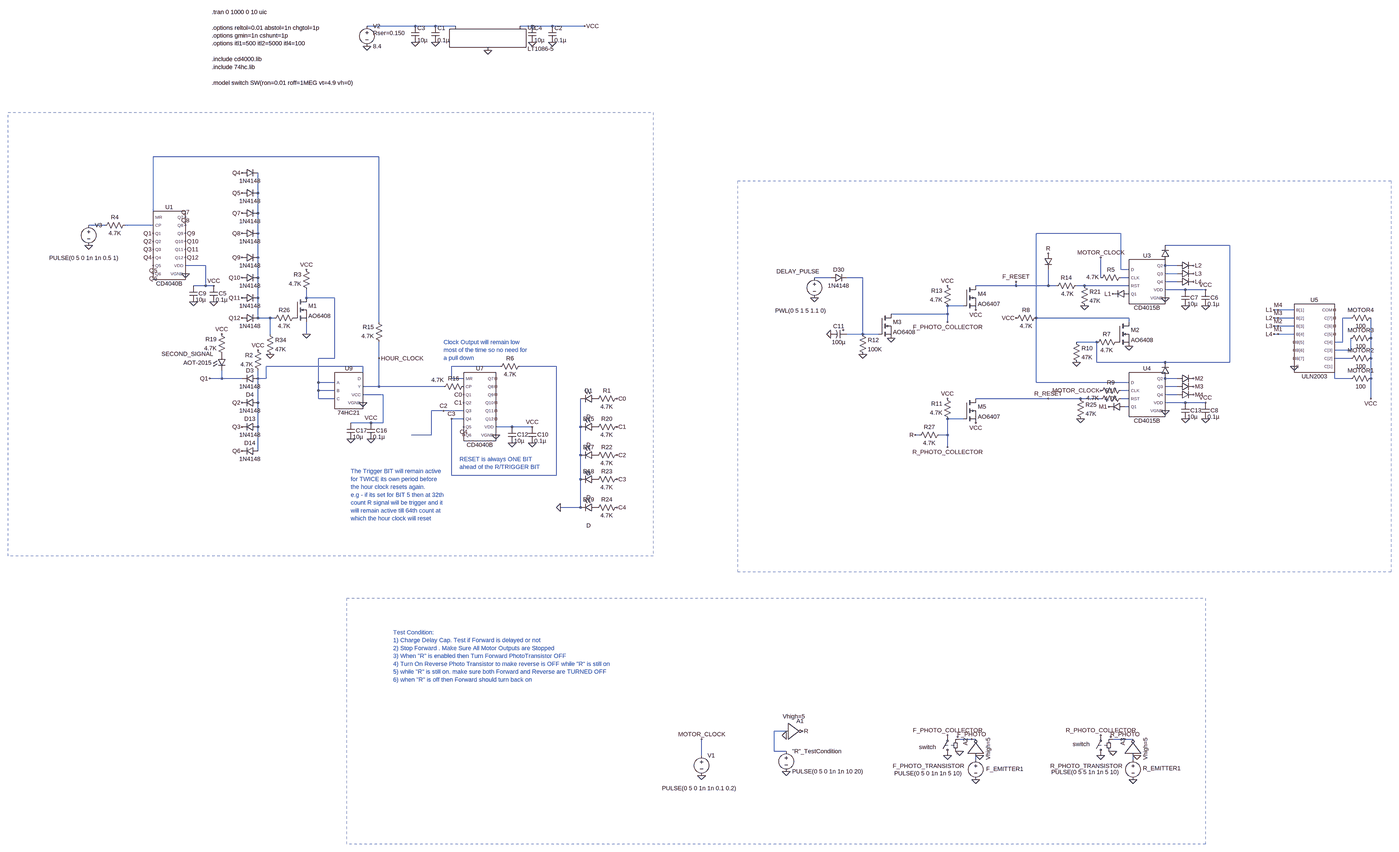
[diagram p0: schematic Draft3_CD4060.asc, whole sheet]
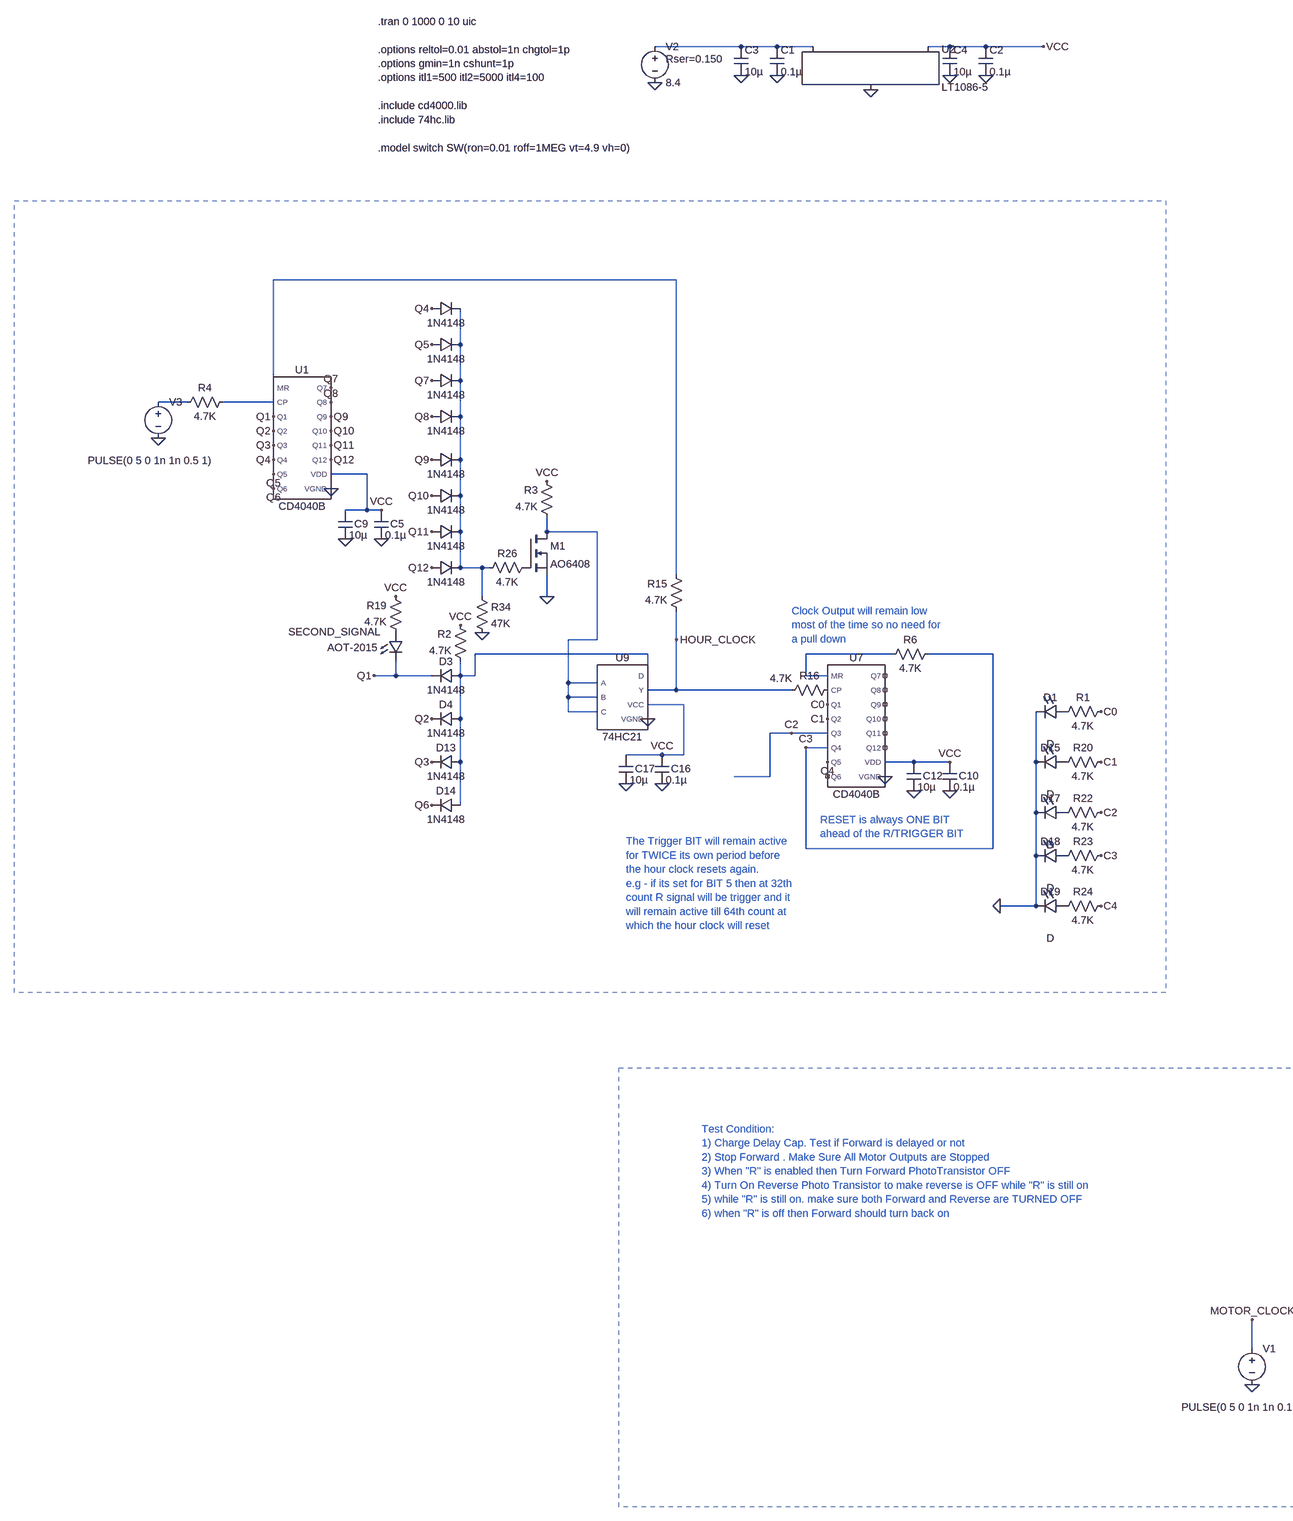
[diagram p1: schematic Draft3_CD4060.asc, part, row 1 of 1, column 1 of 2]
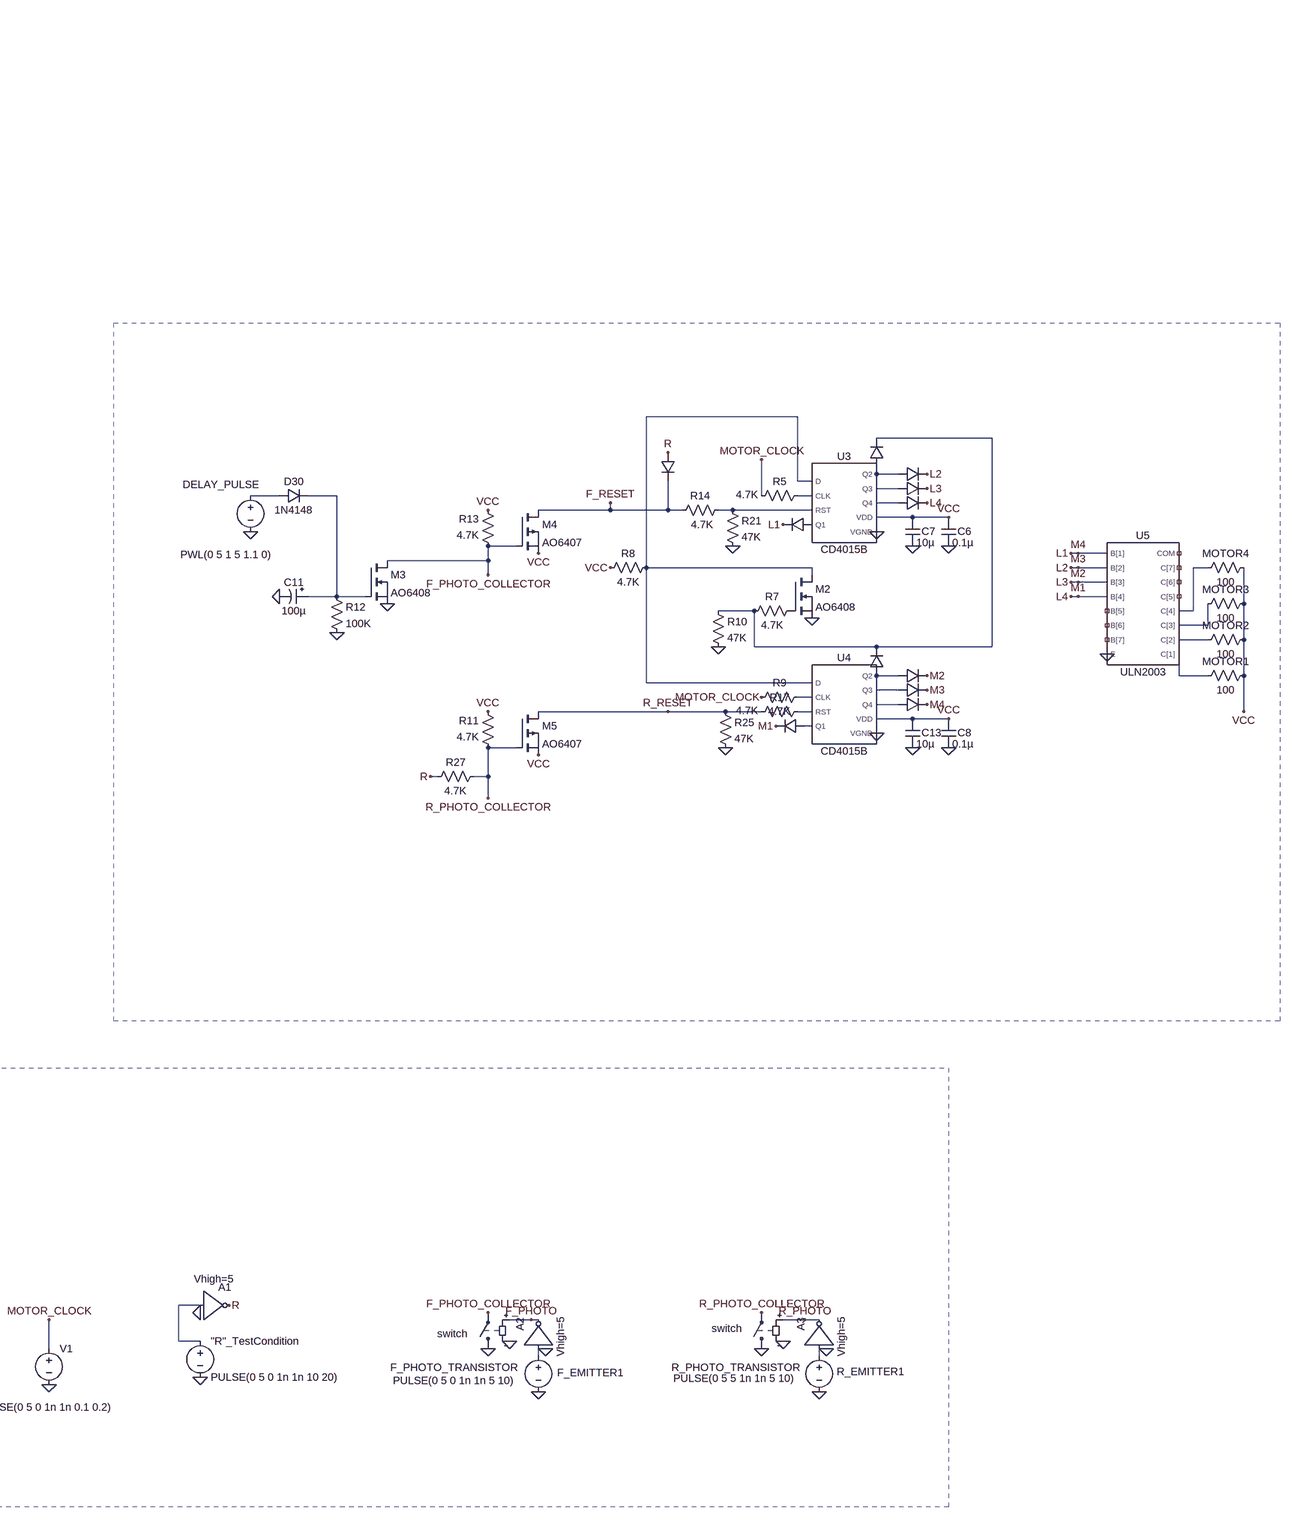
[diagram p2: schematic Draft3_CD4060.asc, part, row 1 of 1, column 2 of 2]
Draft3_CD4060.asc, the LTspice schematic file:
Version 4
SHEET 1 3252 2292
WIRE -1248 -1328 -1440 -1328
WIRE -1168 -1328 -1248 -1328
WIRE -1088 -1328 -1168 -1328
WIRE -784 -1328 -832 -1328
WIRE -704 -1328 -784 -1328
WIRE -576 -1328 -704 -1328
WIRE -1392 -448 -2288 -448
WIRE -1872 -304 -1872 -384
WIRE -1872 -224 -1872 -304
WIRE -2288 -208 -2288 -448
WIRE -2480 -176 -2544 -176
WIRE -2288 -176 -2400 -176
WIRE -1872 -144 -1872 -224
WIRE 1552 -144 1216 -144
WIRE 1984 -96 1728 -96
WIRE -1872 -48 -1872 -144
WIRE -2080 -16 -2160 -16
WIRE 1728 -16 1728 -32
WIRE 1776 -16 1728 -16
WIRE 1552 0 1552 -144
WIRE 1584 0 1552 0
WIRE 1776 16 1728 16
WIRE -1872 32 -1872 -48
WIRE 400 32 336 32
WIRE 528 32 464 32
WIRE 1472 32 1472 -48
WIRE 1584 32 1552 32
WIRE 1776 48 1728 48
WIRE -2080 64 -2080 -16
WIRE -2080 64 -2128 64
WIRE -2048 64 -2080 64
WIRE 1136 64 1136 48
WIRE 1136 64 976 64
WIRE 1264 64 1264 0
WIRE 1264 64 1136 64
WIRE 1296 64 1264 64
WIRE 1408 64 1376 64
WIRE 1584 64 1408 64
WIRE 1808 80 1728 80
WIRE 1888 80 1808 80
WIRE -1872 112 -1872 32
WIRE -1680 112 -1680 80
WIRE -1568 112 -1680 112
WIRE 928 144 864 144
WIRE 2176 160 2160 160
WIRE 2240 160 2176 160
WIRE 864 176 864 144
WIRE 864 176 640 176
WIRE -1872 192 -1872 112
WIRE -1824 192 -1872 192
WIRE -1808 192 -1824 192
WIRE 1216 192 1216 -144
WIRE 1584 192 1216 192
WIRE 2176 192 2160 192
WIRE 2240 192 2176 192
WIRE 2464 192 2432 192
WIRE -1392 208 -1392 -448
WIRE 864 208 864 176
WIRE 1584 208 1584 192
WIRE 2176 224 2160 224
WIRE 2240 224 2176 224
WIRE -1824 256 -1824 192
WIRE -1680 256 -1680 208
WIRE 528 256 528 32
WIRE 528 256 464 256
WIRE 592 256 528 256
WIRE 2176 256 2160 256
WIRE 2240 256 2176 256
WIRE 2544 272 2544 192
WIRE 1456 288 1376 288
WIRE 2432 288 2432 192
WIRE 2432 288 2400 288
WIRE 2464 320 2464 272
WIRE 2464 320 2400 320
WIRE -1568 352 -1568 112
WIRE -1568 352 -1632 352
WIRE -1392 352 -1392 288
WIRE 2464 352 2400 352
WIRE 2544 352 2544 272
WIRE 1456 368 1456 288
WIRE 1728 368 1456 368
WIRE 1984 368 1984 -96
WIRE 1984 368 1728 368
WIRE -1456 384 -1840 384
WIRE -912 384 -1104 384
WIRE -688 384 -832 384
WIRE -2016 432 -2016 400
WIRE -2016 432 -2064 432
WIRE -1936 432 -2016 432
WIRE -1872 432 -1872 400
WIRE -1840 432 -1840 384
WIRE -1840 432 -1872 432
WIRE -1456 432 -1456 384
WIRE -1104 432 -1104 384
WIRE -1056 432 -1104 432
WIRE 1776 432 1728 432
WIRE 2400 432 2400 384
WIRE 2464 432 2400 432
WIRE 2544 432 2544 352
WIRE -1632 448 -1632 352
WIRE -1568 448 -1632 448
WIRE 1216 448 1216 192
WIRE 1584 448 1216 448
WIRE -1392 464 -1392 352
WIRE -1392 464 -1456 464
WIRE -1136 464 -1392 464
WIRE 1776 464 1728 464
WIRE -1632 480 -1632 448
WIRE -1568 480 -1632 480
WIRE 1584 480 1552 480
WIRE -1376 496 -1456 496
WIRE 1776 496 1728 496
WIRE -1632 512 -1632 480
WIRE -1568 512 -1632 512
WIRE 1264 512 976 512
WIRE 1392 512 1264 512
WIRE 1472 512 1392 512
WIRE 1584 512 1552 512
WIRE 2544 512 2544 432
WIRE -1872 528 -1872 432
WIRE 1808 528 1728 528
WIRE 1888 528 1808 528
WIRE 1584 544 1568 544
WIRE -1136 560 -1184 560
WIRE -1056 560 -1136 560
WIRE -1056 592 -1104 592
WIRE 928 592 864 592
WIRE -1424 608 -1504 608
WIRE -1376 608 -1376 496
WIRE -1376 608 -1424 608
WIRE -1872 624 -1872 528
WIRE -864 624 -928 624
WIRE -784 624 -864 624
WIRE -592 624 -592 512
WIRE -1184 656 -1184 560
WIRE -1184 656 -1264 656
WIRE 752 656 736 656
WIRE 864 656 864 592
WIRE 864 656 832 656
WIRE 864 704 864 656
WIRE -1872 720 -1872 624
WIRE -592 736 -592 624
WIRE -1104 816 -1104 592
WIRE -688 816 -688 384
WIRE -688 816 -1104 816
WIRE -592 832 -592 736
WIRE -592 944 -592 832
WIRE -592 944 -672 944
WIRE 224 1840 176 1840
WIRE 960 1872 912 1872
WIRE 976 1872 960 1872
WIRE 1568 1872 1520 1872
WIRE 1600 1872 1568 1872
WIRE 176 1920 176 1840
WIRE 224 1920 176 1920
WIRE -112 1936 -112 1872
WIRE 976 1952 976 1936
WIRE 1600 1952 1600 1936
FLAG -1248 -1264 0
FLAG -1168 -1264 0
FLAG -960 -1232 0
FLAG -784 -1264 0
FLAG -704 -1264 0
FLAG -1440 -1248 0
FLAG -576 -1328 VCC
FLAG -2160 16 0
FLAG -1936 -384 Q4
FLAG -1936 -304 Q5
FLAG -2288 -144 Q1
FLAG -2288 -112 Q2
FLAG -2288 -80 Q3
FLAG -2288 -48 Q4
FLAG -2288 -16 Q5
FLAG -2288 16 Q6
FLAG -2160 -208 Q7
FLAG -2160 -176 Q8
FLAG -2160 -144 Q9
FLAG -2160 -112 Q10
FLAG -2160 -80 Q11
FLAG -2160 -48 Q12
FLAG 864 1936 0
FLAG 1600 2032 0
FLAG 1472 1936 0
FLAG 976 2032 0
FLAG -1424 608 VCC
FLAG -1504 672 0
FLAG -1424 672 0
FLAG -1456 528 0
FLAG -2064 432 Q1
FLAG -1936 528 Q2
FLAG -1936 624 Q3
FLAG -1936 720 Q6
FLAG -1680 256 0
FLAG -1936 -224 Q7
FLAG -1936 -144 Q8
FLAG -1936 -48 Q9
FLAG -1936 32 Q10
FLAG -1936 112 Q11
FLAG -1936 192 Q12
FLAG 1520 1920 0
FLAG 912 1920 0
FLAG -1824 336 0
FLAG -2544 -96 0
FLAG -1680 0 VCC
FLAG -1872 320 VCC
FLAG -2048 64 VCC
FLAG -2128 128 0
FLAG -2048 128 0
FLAG -864 688 0
FLAG -784 688 0
FLAG -928 656 0
FLAG -2016 256 VCC
FLAG -1392 352 HOUR_CLOCK
FLAG -1056 496 C0
FLAG -1056 528 C1
FLAG -1136 560 C2
FLAG -1104 592 C3
FLAG -1056 624 C4
FLAG -448 512 C0
FLAG -448 624 C1
FLAG -448 736 C2
FLAG -448 832 C3
FLAG -448 944 C4
FLAG -672 944 0
FLAG -784 624 VCC
FLAG 1808 144 0
FLAG 1888 144 0
FLAG 1888 80 VCC
FLAG 1728 112 0
FLAG 1472 -48 MOTOR_CLOCK
FLAG 1840 -16 L2
FLAG 1520 96 L1
FLAG 1840 48 L4
FLAG 1584 304 0
FLAG 1136 192 VCC
FLAG 1808 592 0
FLAG 1888 592 0
FLAG 1888 528 VCC
FLAG 1728 560 0
FLAG 1472 480 MOTOR_CLOCK
FLAG 1840 432 M2
FLAG 1504 544 M1
FLAG 1840 464 M3
FLAG 1840 496 M4
FLAG 1840 16 L3
FLAG 2240 384 0
FLAG -112 2016 0
FLAG -112 1872 MOTOR_CLOCK
FLAG 2544 512 VCC
FLAG 1136 48 F_RESET
FLAG 1264 512 R_RESET
FLAG 1376 368 0
FLAG 2160 160 L1
FLAG 2160 192 L2
FLAG 2160 224 L3
FLAG 2160 256 L4
FLAG 2176 160 M4
FLAG 2176 192 M3
FLAG 2176 224 M2
FLAG 2176 256 M1
FLAG 976 160 VCC
FLAG 976 608 VCC
FLAG 864 512 VCC
FLAG 864 64 VCC
FLAG 736 656 R
FLAG 1392 592 0
FLAG 1264 -64 R
FLAG 224 2000 0
FLAG 288 1840 R
FLAG 1568 1872 R_PHOTO
FLAG 960 1872 F_PHOTO
FLAG 336 112 0
FLAG 224 1856 0
FLAG 992 1936 0
FLAG 400 256 0
FLAG 1408 144 0
FLAG 640 272 0
FLAG 528 336 0
FLAG 864 1856 F_PHOTO_COLLECTOR
FLAG 1472 1856 R_PHOTO_COLLECTOR
FLAG 864 208 F_PHOTO_COLLECTOR
FLAG 864 704 R_PHOTO_COLLECTOR
FLAG 1616 1936 0
SYMBOL CD4040B -2224 -96 R0
WINDOW 39 0 160 Invisible 2
SYMATTR InstName U1
SYMATTR Value2 vdd=5 speed=1 tripdt=5n
SYMBOL PowerProducts\\LT1086-5 -960 -1328 R0
SYMATTR InstName U2
SYMBOL cap -1184 -1328 R0
SYMATTR InstName C1
SYMATTR Value 0.1µ
SYMATTR SpiceLine V=25 Irms=0 Rser=0.025 Lser=800p mfg="Würth Elektronik" pn="885012206071 WCAP-CSGP 0603" type="X7R"
SYMBOL cap -1264 -1328 R0
SYMATTR InstName C3
SYMATTR Value 10µ
SYMATTR SpiceLine V=25 Irms=0 Rser=0 Lser=0 mfg="Murata" pn="GRM21BR61E106KA73" type="X5R"
SYMBOL cap -720 -1328 R0
SYMATTR InstName C2
SYMATTR Value 0.1µ
SYMATTR SpiceLine V=25 Irms=0 Rser=0.025 Lser=800p mfg="Würth Elektronik" pn="885012206071 WCAP-CSGP 0603" type="X7R"
SYMBOL cap -800 -1328 R0
SYMATTR InstName C4
SYMATTR Value 10µ
SYMATTR SpiceLine V=25 Irms=0 Rser=0 Lser=0 mfg="Murata" pn="GRM21BR61E106KA73" type="X5R"
SYMBOL voltage -1440 -1344 R0
WINDOW 123 0 0 Left 0
WINDOW 39 24 44 Left 2
SYMATTR SpiceLine Rser=0.150
SYMATTR InstName V2
SYMATTR Value 8.4
SYMBOL diode -1936 -368 R270
WINDOW 0 32 32 Invisible 2
WINDOW 3 0 32 VBottom 2
SYMATTR InstName D5
SYMATTR Value 1N4148
SYMBOL diode -1936 -288 R270
WINDOW 0 32 32 Invisible 2
WINDOW 3 0 32 VBottom 2
SYMATTR InstName D6
SYMATTR Value 1N4148
SYMBOL diode -1936 -208 R270
WINDOW 0 32 32 Invisible 2
WINDOW 3 0 32 VBottom 2
SYMATTR InstName D7
SYMATTR Value 1N4148
SYMBOL diode -1936 -128 R270
WINDOW 0 32 32 Invisible 2
WINDOW 3 0 32 VBottom 2
SYMATTR InstName D8
SYMATTR Value 1N4148
SYMBOL diode -1936 -32 R270
WINDOW 0 32 32 Invisible 2
WINDOW 3 0 32 VBottom 2
SYMATTR InstName D9
SYMATTR Value 1N4148
SYMBOL diode -1936 48 R270
WINDOW 0 32 32 Invisible 2
WINDOW 3 0 32 VBottom 2
SYMATTR InstName D10
SYMATTR Value 1N4148
SYMBOL diode -1936 128 R270
WINDOW 0 32 32 Invisible 2
WINDOW 3 0 32 VBottom 2
SYMATTR InstName D11
SYMATTR Value 1N4148
SYMBOL diode -1936 208 R270
WINDOW 0 32 32 Invisible 2
WINDOW 3 0 32 VBottom 2
SYMATTR InstName D12
SYMATTR Value 1N4148
SYMBOL res -2384 -192 R90
WINDOW 0 0 56 VBottom 2
WINDOW 3 32 56 VTop 2
SYMATTR InstName R4
SYMATTR Value 4.7K
SYMBOL ULN2003 2320 272 R0
SYMATTR InstName U5
SYMBOL sw 864 1952 R180
WINDOW 3 46 49 Left 2
WINDOW 0 -65 -26 Left 2
SYMATTR Value switch
SYMATTR InstName F_PHOTO_TRANSISTOR
SYMBOL voltage 1600 1936 R0
WINDOW 0 39 51 Left 2
WINDOW 3 -324 66 Left 2
WINDOW 123 0 0 Left 0
WINDOW 39 0 0 Left 0
SYMATTR InstName R_EMITTER1
SYMATTR Value PULSE(0 5 5 1n 1n 5 10)
SYMBOL sw 1472 1952 R180
WINDOW 3 44 61 Left 2
WINDOW 0 -84 -26 Left 2
SYMATTR Value switch
SYMATTR InstName R_PHOTO_TRANSISTOR
SYMBOL voltage 976 1936 R0
WINDOW 0 42 54 Left 2
WINDOW 3 -323 71 Left 2
WINDOW 123 0 0 Left 0
WINDOW 39 0 0 Left 0
SYMATTR InstName F_EMITTER1
SYMATTR Value PULSE(0 5 0 1n 1n 5 10)
SYMBOL res -1712 176 R90
WINDOW 0 0 56 VBottom 2
WINDOW 3 32 56 VTop 2
SYMATTR InstName R26
SYMATTR Value 4.7K
SYMBOL 74HC21 -1520 480 R0
WINDOW 39 8 96 Invisible 2
SYMATTR InstName U9
SYMATTR Value2 vcc=5 speed=1 tripdt=5n
SYMBOL cap -1440 608 R0
WINDOW 0 36 31 Left 2
SYMATTR InstName C16
SYMATTR Value 0.1µ
SYMATTR SpiceLine V=25 Irms=0 Rser=0.025 Lser=800p mfg="Würth Elektronik" pn="885012206071 WCAP-CSGP 0603" type="X7R"
SYMBOL cap -1520 608 R0
WINDOW 0 36 31 Left 2
SYMATTR InstName C17
SYMATTR Value 10µ
SYMATTR SpiceLine V=25 Irms=0 Rser=0 Lser=0 mfg="Murata" pn="GRM21BR61E106KA73" type="X5R"
SYMBOL nmos -1728 112 R0
SYMATTR InstName M1
SYMATTR Value AO6408
SYMBOL res -1840 240 R0
SYMATTR InstName R34
SYMATTR Value 47K
SYMBOL voltage -2544 -192 R0
WINDOW 3 -157 146 Left 2
WINDOW 123 0 0 Left 0
WINDOW 39 0 0 Left 0
SYMATTR InstName V3
SYMATTR Value PULSE(0 5 0 1n 1n 0.5 1)
SYMBOL res -1664 96 R180
WINDOW 0 36 76 Left 2
WINDOW 3 36 40 Left 2
SYMATTR InstName R3
SYMATTR Value 4.7K
SYMBOL diode -1872 416 R90
WINDOW 0 0 32 VBottom 2
WINDOW 3 32 32 VTop 2
SYMATTR InstName D3
SYMATTR Value 1N4148
SYMBOL diode -1872 512 R90
WINDOW 0 0 32 VBottom 2
WINDOW 3 32 32 VTop 2
SYMATTR InstName D4
SYMATTR Value 1N4148
SYMBOL diode -1872 608 R90
WINDOW 0 0 32 VBottom 2
WINDOW 3 32 32 VTop 2
SYMATTR InstName D13
SYMATTR Value 1N4148
SYMBOL diode -1872 704 R90
WINDOW 0 0 32 VBottom 2
WINDOW 3 32 32 VTop 2
SYMATTR InstName D14
SYMATTR Value 1N4148
SYMBOL res -1856 416 R180
WINDOW 0 36 76 Left 2
WINDOW 3 36 40 Left 2
SYMATTR InstName R2
SYMATTR Value 4.7K
SYMBOL res -1376 304 R180
WINDOW 0 36 76 Left 2
WINDOW 3 36 40 Left 2
SYMATTR InstName R15
SYMATTR Value 4.7K
SYMBOL CD4040B -992 544 R0
WINDOW 39 0 160 Invisible 2
SYMATTR InstName U7
SYMATTR Value2 vdd=5 speed=1 tripdt=5n
SYMBOL res -1152 480 R270
WINDOW 0 32 56 VTop 2
WINDOW 3 58 -7 VBottom 2
SYMATTR InstName R16
SYMATTR Value 4.7K
SYMBOL cap -2064 64 R0
WINDOW 0 36 31 Left 2
SYMATTR InstName C5
SYMATTR Value 0.1µ
SYMATTR SpiceLine V=25 Irms=0 Rser=0.025 Lser=800p mfg="Würth Elektronik" pn="885012206071 WCAP-CSGP 0603" type="X7R"
SYMBOL cap -2144 64 R0
WINDOW 0 36 31 Left 2
SYMATTR InstName C9
SYMATTR Value 10µ
SYMATTR SpiceLine V=25 Irms=0 Rser=0 Lser=0 mfg="Murata" pn="GRM21BR61E106KA73" type="X5R"
SYMBOL cap -800 624 R0
WINDOW 0 36 31 Left 2
SYMATTR InstName C10
SYMATTR Value 0.1µ
SYMATTR SpiceLine V=25 Irms=0 Rser=0.025 Lser=800p mfg="Würth Elektronik" pn="885012206071 WCAP-CSGP 0603" type="X7R"
SYMBOL cap -880 624 R0
WINDOW 0 36 31 Left 2
SYMATTR InstName C12
SYMATTR Value 10µ
SYMATTR SpiceLine V=25 Irms=0 Rser=0 Lser=0 mfg="Murata" pn="GRM21BR61E106KA73" type="X5R"
SYMBOL res -816 368 R90
WINDOW 0 0 56 VBottom 2
WINDOW 3 32 56 VTop 2
SYMATTR InstName R6
SYMATTR Value 4.7K
SYMBOL res -2000 352 R180
WINDOW 0 36 76 Left 2
WINDOW 3 36 40 Left 2
SYMATTR InstName R19
SYMATTR Value 4.7K
SYMBOL LED -2032 336 R0
WINDOW 0 -223 -1 Left 2
WINDOW 3 -136 34 Left 2
SYMATTR InstName SECOND_SIGNAL
SYMATTR Value AOT-2015
SYMBOL res -432 496 R90
WINDOW 0 0 56 VBottom 2
WINDOW 3 32 56 VTop 2
SYMATTR InstName R1
SYMATTR Value 4.7K
SYMBOL res -432 608 R90
WINDOW 0 0 56 VBottom 2
WINDOW 3 32 56 VTop 2
SYMATTR InstName R20
SYMATTR Value 4.7K
SYMBOL res -432 720 R90
WINDOW 0 0 56 VBottom 2
WINDOW 3 32 56 VTop 2
SYMATTR InstName R22
SYMATTR Value 4.7K
SYMBOL res -432 816 R90
WINDOW 0 0 56 VBottom 2
WINDOW 3 32 56 VTop 2
SYMATTR InstName R23
SYMATTR Value 4.7K
SYMBOL res -432 928 R90
WINDOW 0 0 56 VBottom 2
WINDOW 3 32 56 VTop 2
SYMATTR InstName R24
SYMATTR Value 4.7K
SYMBOL LED -528 496 R90
WINDOW 0 0 32 VBottom 2
WINDOW 3 72 32 VTop 2
SYMATTR InstName D1
SYMBOL LED -528 608 R90
WINDOW 0 0 32 VBottom 2
WINDOW 3 72 32 VTop 2
SYMATTR InstName D15
SYMBOL LED -528 720 R90
WINDOW 0 0 32 VBottom 2
WINDOW 3 72 32 VTop 2
SYMATTR InstName D17
SYMBOL LED -528 816 R90
WINDOW 0 0 32 VBottom 2
WINDOW 3 72 32 VTop 2
SYMATTR InstName D18
SYMBOL LED -528 928 R90
WINDOW 0 0 32 VBottom 2
WINDOW 3 72 32 VTop 2
SYMATTR InstName D19
SYMBOL CD4015B 1648 48 R0
WINDOW 39 8 112 Invisible 2
SYMATTR InstName U3
SYMATTR Value2 vdd=5 speed=1 tripdt=5n
SYMBOL cap 1872 80 R0
WINDOW 0 36 31 Left 2
SYMATTR InstName C6
SYMATTR Value 0.1µ
SYMATTR SpiceLine V=25 Irms=0 Rser=0.025 Lser=800p mfg="Würth Elektronik" pn="885012206071 WCAP-CSGP 0603" type="X7R"
SYMBOL cap 1792 80 R0
WINDOW 0 36 31 Left 2
SYMATTR InstName C7
SYMATTR Value 10µ
SYMATTR SpiceLine V=25 Irms=0 Rser=0 Lser=0 mfg="Murata" pn="GRM21BR61E106KA73" type="X5R"
SYMBOL res 1568 16 R90
WINDOW 0 0 56 VBottom 2
WINDOW 3 -2 128 VTop 2
SYMATTR InstName R5
SYMATTR Value 4.7K
SYMBOL nmos 1536 208 R0
SYMATTR InstName M2
SYMATTR Value AO6408
SYMBOL res 1552 272 R90
WINDOW 0 0 56 VBottom 2
WINDOW 3 32 56 VTop 2
SYMATTR InstName R7
SYMATTR Value 4.7K
SYMBOL res 1232 176 R90
WINDOW 0 0 56 VBottom 2
WINDOW 3 32 56 VTop 2
SYMATTR InstName R8
SYMATTR Value 4.7K
SYMBOL CD4015B 1648 496 R0
WINDOW 39 8 112 Invisible 2
SYMATTR InstName U4
SYMATTR Value2 vdd=5 speed=1 tripdt=5n
SYMBOL cap 1872 528 R0
WINDOW 0 36 31 Left 2
SYMATTR InstName C8
SYMATTR Value 0.1µ
SYMATTR SpiceLine V=25 Irms=0 Rser=0.025 Lser=800p mfg="Würth Elektronik" pn="885012206071 WCAP-CSGP 0603" type="X7R"
SYMBOL cap 1792 528 R0
WINDOW 0 36 31 Left 2
SYMATTR InstName C13
SYMATTR Value 10µ
SYMATTR SpiceLine V=25 Irms=0 Rser=0 Lser=0 mfg="Murata" pn="GRM21BR61E106KA73" type="X5R"
SYMBOL res 1568 464 R90
WINDOW 0 0 56 VBottom 2
WINDOW 3 32 56 VTop 2
SYMATTR InstName R9
SYMATTR Value 4.7K
SYMBOL diode 1584 80 R90
WINDOW 0 0 32 Invisible 2
WINDOW 3 32 32 Invisible 2
SYMATTR InstName D20
SYMATTR Value 1N4148
SYMBOL diode 1776 0 R270
WINDOW 0 32 32 Invisible 2
WINDOW 3 0 32 Invisible 2
SYMATTR InstName D21
SYMATTR Value 1N4148
SYMBOL diode 1776 32 R270
WINDOW 0 32 32 Invisible 2
WINDOW 3 0 32 Invisible 2
SYMATTR InstName D22
SYMATTR Value 1N4148
SYMBOL diode 1776 64 R270
WINDOW 0 32 32 Invisible 2
WINDOW 3 0 32 Invisible 2
SYMATTR InstName D23
SYMATTR Value 1N4148
SYMBOL diode 1776 448 R270
WINDOW 0 32 32 Invisible 2
WINDOW 3 0 32 Invisible 2
SYMATTR InstName D24
SYMATTR Value 1N4148
SYMBOL diode 1776 480 R270
WINDOW 0 32 32 Invisible 2
WINDOW 3 0 32 Invisible 2
SYMATTR InstName D25
SYMATTR Value 1N4148
SYMBOL diode 1776 512 R270
WINDOW 0 32 32 Invisible 2
WINDOW 3 0 32 Invisible 2
SYMATTR InstName D26
SYMATTR Value 1N4148
SYMBOL diode 1568 528 R90
WINDOW 0 0 32 Invisible 2
WINDOW 3 32 32 Invisible 2
SYMATTR InstName D27
SYMATTR Value 1N4148
SYMBOL voltage -112 1920 R0
WINDOW 3 -157 146 Left 2
WINDOW 123 0 0 Left 0
WINDOW 39 0 0 Left 0
SYMATTR InstName V1
SYMATTR Value PULSE(0 5 0 1n 1n 0.1 0.2)
SYMBOL res 2560 416 R90
WINDOW 0 0 56 VBottom 2
WINDOW 3 32 56 VTop 2
SYMATTR InstName MOTOR1
SYMATTR Value 100
SYMBOL res 2560 336 R90
WINDOW 0 0 56 VBottom 2
WINDOW 3 32 56 VTop 2
SYMATTR InstName MOTOR2
SYMATTR Value 100
SYMBOL res 2560 256 R90
WINDOW 0 0 56 VBottom 2
WINDOW 3 32 56 VTop 2
SYMATTR InstName MOTOR3
SYMATTR Value 100
SYMBOL res 2560 176 R90
WINDOW 0 0 56 VBottom 2
WINDOW 3 32 56 VTop 2
SYMATTR InstName MOTOR4
SYMATTR Value 100
SYMBOL diode 1744 -32 R180
WINDOW 0 24 64 Invisible 2
WINDOW 3 24 0 Invisible 2
SYMATTR InstName D2
SYMATTR Value 1N4148
SYMBOL diode 1744 432 R180
WINDOW 0 24 64 Invisible 2
WINDOW 3 24 0 Invisible 2
SYMATTR InstName D16
SYMATTR Value 1N4148
SYMBOL res 1360 272 R0
SYMATTR InstName R10
SYMATTR Value 47K
SYMBOL pmos 928 64 R0
SYMATTR InstName M4
SYMATTR Value AO6407
SYMBOL pmos 928 512 R0
SYMATTR InstName M5
SYMATTR Value AO6407
SYMBOL res 880 608 R180
WINDOW 0 36 76 Left 2
WINDOW 3 36 40 Left 2
SYMATTR InstName R11
SYMATTR Value 4.7K
SYMBOL res 880 160 R180
WINDOW 0 36 76 Left 2
WINDOW 3 36 40 Left 2
SYMATTR InstName R13
SYMATTR Value 4.7K
SYMBOL res 1392 48 R90
WINDOW 0 0 56 VBottom 2
WINDOW 3 33 52 VTop 2
SYMATTR InstName R14
SYMATTR Value 4.7K
SYMBOL res 1568 496 R90
WINDOW 0 0 56 VBottom 2
WINDOW 3 -2 128 VTop 2
SYMATTR InstName R17
SYMATTR Value 4.7K
SYMBOL res 1376 496 R0
SYMATTR InstName R25
SYMATTR Value 47K
SYMBOL diode 1248 -64 R0
WINDOW 0 24 0 Invisible 2
WINDOW 3 24 64 Invisible 2
SYMATTR InstName D29
SYMATTR Value 1N4148
SYMBOL voltage 224 1904 R0
WINDOW 123 0 0 Left 0
WINDOW 39 0 0 Left 0
SYMATTR InstName "R"_TestCondition
SYMATTR Value PULSE(0 5 0 1n 1n 10 20)
SYMBOL res 736 672 R270
WINDOW 0 32 56 VTop 2
WINDOW 3 0 56 VBottom 2
SYMATTR InstName R27
SYMATTR Value 4.7K
SYMBOL voltage 336 16 R0
WINDOW 0 -151 -9 Left 2
WINDOW 3 -156 147 Left 2
SYMATTR InstName DELAY_PULSE
SYMATTR Value PWL(0 5 1 5 1.1 0)
SYMBOL Digital\\inv 224 1776 R0
WINDOW 3 -14 5 Left 2
SYMATTR InstName A1
SYMATTR Value Vhigh=5
SYMBOL Digital\\inv 912 1936 R270
WINDOW 3 -18 114 Left 2
SYMATTR InstName A2
SYMATTR Value Vhigh=5
SYMBOL diode 400 48 R270
WINDOW 0 32 32 VTop 2
WINDOW 3 0 32 VBottom 2
SYMATTR InstName D30
SYMATTR Value 1N4148
SYMBOL polcap 464 240 R90
WINDOW 0 0 32 VBottom 2
WINDOW 3 32 32 VTop 2
SYMATTR InstName C11
SYMATTR Value 100µ
SYMATTR Description Capacitor
SYMATTR Type cap
SYMATTR SpiceLine V=25 Irms=300m Rser=0.284 Lser=21.232n mfg="Würth Elektronik" pn="865080449011 WCAP-ASLI 8x6,5" type="Al electrolytic"
SYMBOL res 1392 48 R0
SYMATTR InstName R21
SYMATTR Value 47K
SYMBOL nmos 592 176 R0
SYMATTR InstName M3
SYMATTR Value AO6408
SYMBOL res 512 240 R0
SYMATTR InstName R12
SYMATTR Value 100K
SYMBOL Digital\\inv 1536 1936 R270
WINDOW 3 -18 114 Left 2
SYMATTR InstName A3
SYMATTR Value Vhigh=5
TEXT -2056 -1384 Left 2 !.tran 0 1000 0 10 uic\n \n.options reltol=0.01 abstol=1n chgtol=1p\n.options gmin=1n cshunt=1p\n.options itl1=500 itl2=5000 itl4=100\n \n.include cd4000.lib\n.include 74hc.lib\n \n.model switch SW(ron=0.01 roff=1MEG vt=4.9 vh=0)
TEXT -1504 800 Left 2 ;The Trigger BIT will remain active \nfor TWICE its own period before\nthe hour clock resets again.\ne.g - if its set for BIT 5 then at 32th\ncount R signal will be trigger and it \nwill remain active till 64th count at \nwhich the hour clock will reset
TEXT -1072 752 Left 2 ;RESET is always ONE BIT \nahead of the R/TRIGGER BIT
TEXT -1336 1448 Left 2 ;Test Condition:\n1) Charge Delay Cap. Test if Forward is delayed or not\n2) Stop Forward . Make Sure All Motor Outputs are Stopped\n3) When "R" is enabled then Turn Forward PhotoTransistor OFF\n4) Turn On Reverse Photo Transistor to make reverse is OFF while "R" is still on \n5) while "R" is still on. make sure both Forward and Reverse are TURNED OFF\n6) when "R" is off then Forward should turn back on
TEXT -1136 288 Left 2 ;Clock Output will remain low \nmost of the time so no need for \na pull down
RECTANGLE Normal -304 1136 -2864 -624 2
RECTANGLE Normal 2624 1200 32 -352 2
RECTANGLE Normal 1888 2288 -1520 1312 2

The netlist it stands for:
* Draft3_CD4060.asc
XU1 N002 N005 Q1 Q2 Q3 Q4 Q5 Q6 Q7 Q8 Q9 Q10 Q11 Q12 VCC 0 CD4040B vdd=5 speed=1 tripdt=5n vdd1={vdd} speed1={speed} tripdt1={tripdt}  ; pins MR CP Q1 Q2 Q3 Q4 Q5 Q6 Q7 Q8 Q9 Q10 Q11 Q12 VDD VGND
XU2 0 VCC N001 LT1086-5
C1 N001 0 0.1µ V=25 Irms=0 Rser=0.025 Lser=800p mfg="Würth Elektronik" pn="885012206071 WCAP-CSGP 0603" type="X7R"
C3 N001 0 10µ V=25 Irms=0 Rser=0 Lser=0 mfg="Murata" pn="GRM21BR61E106KA73" type="X5R"
C2 VCC 0 0.1µ V=25 Irms=0 Rser=0.025 Lser=800p mfg="Würth Elektronik" pn="885012206071 WCAP-CSGP 0603" type="X7R"
C4 VCC 0 10µ V=25 Irms=0 Rser=0 Lser=0 mfg="Murata" pn="GRM21BR61E106KA73" type="X5R"
V2 N001 0 8.4 Rser=0.150
D5 Q4 N003 1N4148
D6 Q5 N003 1N4148
D7 Q7 N003 1N4148
D8 Q8 N003 1N4148
D9 Q9 N003 1N4148
D10 Q10 N003 1N4148
D11 Q11 N003 1N4148
D12 Q12 N003 1N4148
R4 N005 N004 4.7K
XU5 M4 M3 L3 M1 NC_01 NC_02 NC_03 0 NC_04 NC_05 NC_06 NC_07 N016 N017 N018 N022 ULN2003  ; pins B[1] B[2] B[3] B[4] B[5] B[6] B[7] E COM C[7] C[6] C[5] C[4] C[3] C[2] C[1]
S§F_PHOTO_TRANSISTOR 0 F_PHOTO_COLLECTOR F_PHOTO 0 switch
V§R_EMITTER1 N030 0 PULSE(0 5 5 1n 1n 5 10)
S§R_PHOTO_TRANSISTOR 0 R_PHOTO_COLLECTOR R_PHOTO 0 switch
V§F_EMITTER1 N029 0 PULSE(0 5 0 1n 1n 5 10)
R26 P001 N003 4.7K
XU9 N015 N015 N015 N019 HOUR_CLOCK VCC 0 74HC21 vcc=5 speed=1 tripdt=5n vcc1={vcc} speed1={speed} tripdt1={tripdt}  ; pins A B C D Y VCC VGND
C16 VCC 0 0.1µ V=25 Irms=0 Rser=0.025 Lser=800p mfg="Würth Elektronik" pn="885012206071 WCAP-CSGP 0603" type="X7R"
C17 VCC 0 10µ V=25 Irms=0 Rser=0 Lser=0 mfg="Murata" pn="GRM21BR61E106KA73" type="X5R"
M1 N015 P001 0 0 AO6408
R34 N003 0 47K
V3 N004 0 PULSE(0 5 0 1n 1n 0.5 1)
R3 N015 VCC 4.7K
D3 N019 Q1 1N4148
D4 N019 Q2 1N4148
D13 N019 Q3 1N4148
D14 N019 Q6 1N4148
R2 N019 VCC 4.7K
R15 HOUR_CLOCK N002 4.7K
XU7 N020 P002 C0 C1 C2 C3 C4 NC_08 NC_09 NC_10 NC_11 NC_12 NC_13 NC_14 VCC 0 CD4040B vdd=5 speed=1 tripdt=5n vdd1={vdd} speed1={speed} tripdt1={tripdt}  ; pins MR CP Q1 Q2 Q3 Q4 Q5 Q6 Q7 Q8 Q9 Q10 Q11 Q12 VDD VGND
R16 HOUR_CLOCK P002 4.7K
C5 VCC 0 0.1µ V=25 Irms=0 Rser=0.025 Lser=800p mfg="Würth Elektronik" pn="885012206071 WCAP-CSGP 0603" type="X7R"
C9 VCC 0 10µ V=25 Irms=0 Rser=0 Lser=0 mfg="Murata" pn="GRM21BR61E106KA73" type="X5R"
C10 VCC 0 0.1µ V=25 Irms=0 Rser=0.025 Lser=800p mfg="Würth Elektronik" pn="885012206071 WCAP-CSGP 0603" type="X7R"
C12 VCC 0 10µ V=25 Irms=0 Rser=0 Lser=0 mfg="Murata" pn="GRM21BR61E106KA73" type="X5R"
R6 C3 N020 4.7K
R19 P003 VCC 4.7K
D§SECOND_SIGNAL P003 Q1 AOT-2015
R1 C0 P004 4.7K
R20 C1 P005 4.7K
R22 C2 P006 4.7K
R23 C3 P007 4.7K
R24 C4 P008 4.7K
D1 P004 0 D
D15 P005 0 D
D17 P006 0 D
D18 P007 0 D
D19 P008 0 D
XU3 N006 N012 N014 P009 N008 N009 N013 VCC 0 CD4015B vdd=5 speed=1 tripdt=5n vdd1={vdd} speed1={speed} tripdt1={tripdt}  ; pins D CLK RST Q1 Q2 Q3 Q4 VDD VGND
C6 VCC 0 0.1µ V=25 Irms=0 Rser=0.025 Lser=800p mfg="Würth Elektronik" pn="885012206071 WCAP-CSGP 0603" type="X7R"
C7 VCC 0 10µ V=25 Irms=0 Rser=0 Lser=0 mfg="Murata" pn="GRM21BR61E106KA73" type="X5R"
R5 N012 MOTOR_CLOCK 4.7K
M2 N006 P010 0 0 AO6408
R7 P010 N007 4.7K
R8 N006 VCC 4.7K
XU4 N006 N024 N026 N027 N021 N023 N025 VCC 0 CD4015B vdd=5 speed=1 tripdt=5n vdd1={vdd} speed1={speed} tripdt1={tripdt}  ; pins D CLK RST Q1 Q2 Q3 Q4 VDD VGND
C8 VCC 0 0.1µ V=25 Irms=0 Rser=0.025 Lser=800p mfg="Würth Elektronik" pn="885012206071 WCAP-CSGP 0603" type="X7R"
C13 VCC 0 10µ V=25 Irms=0 Rser=0 Lser=0 mfg="Murata" pn="GRM21BR61E106KA73" type="X5R"
R9 N024 MOTOR_CLOCK 4.7K
D20 P009 M4 1N4148
D21 N008 M3 1N4148
D22 N009 L3 1N4148
D23 N013 M1 1N4148
D24 N021 L3 1N4148
D25 N023 M3 1N4148
D26 N025 M4 1N4148
D27 N027 M1 1N4148
V1 MOTOR_CLOCK 0 PULSE(0 5 0 1n 1n 0.1 0.2)
R§MOTOR1 VCC N022 100
R§MOTOR2 VCC N018 100
R§MOTOR3 VCC N017 100
R§MOTOR4 VCC N016 100
D2 N008 N007 1N4148
D16 N021 N007 1N4148
R10 N007 0 47K
M4 F_RESET F_PHOTO_COLLECTOR VCC VCC AO6407
M5 R_RESET R_PHOTO_COLLECTOR VCC VCC AO6407
R11 R_PHOTO_COLLECTOR VCC 4.7K
R13 F_PHOTO_COLLECTOR VCC 4.7K
R14 N014 F_RESET 4.7K
R17 N026 R_RESET 4.7K
R25 R_RESET 0 47K
D29 R F_RESET 1N4148
V§"R"_TestCondition N028 0 PULSE(0 5 0 1n 1n 10 20)
R27 R R_PHOTO_COLLECTOR 4.7K
V§DELAY_PULSE N010 0 PWL(0 5 1 5 1.1 0)
A1 N028 0 0 0 0 R 0 0 BUF Vhigh=5
A2 N029 0 0 0 0 F_PHOTO 0 0 BUF Vhigh=5
D30 N010 N011 1N4148
C11 N011 0 100µ V=25 Irms=300m Rser=0.284 Lser=21.232n mfg="Würth Elektronik" pn="865080449011 WCAP-ASLI 8x6,5" type="Al electrolytic"
R21 N014 0 47K
M3 F_PHOTO_COLLECTOR N011 0 0 AO6408
R12 N011 0 100K
A3 N030 0 0 0 0 R_PHOTO 0 0 BUF Vhigh=5
.model D D
.lib standard.dio
.model NMOS NMOS
.model PMOS PMOS
.lib standard.mos
.tran 0 1000 0 10 uic
.options reltol=0.01 abstol=1n chgtol=1p
.options gmin=1n cshunt=1p
.options itl1=500 itl2=5000 itl4=100
.include cd4000.lib
.include 74hc.lib
.model switch SW(ron=0.01 roff=1MEG vt=4.9 vh=0)
* The Trigger BIT will remain active
* for TWICE its own period before
* the hour clock resets again.
* e.g - if its set for BIT 5 then at 32th
* count R signal will be trigger and it
* will remain active till 64th count at
* which the hour clock will reset
* RESET is always ONE BIT
* ahead of the R/TRIGGER BIT
* Test Condition:
* 1) Charge Delay Cap. Test if Forward is delayed or not
* 2) Stop Forward . Make Sure All Motor Outputs are Stopped
* 3) When "R" is enabled then Turn Forward PhotoTransistor OFF
* 4) Turn On Reverse Photo Transistor to make reverse is OFF while "R" is still on
* 5) while "R" is still on. make sure both Forward and Reverse are TURNED OFF
* 6) when "R" is off then Forward should turn back on
* Clock Output will remain low
* most of the time so no need for
* a pull down
.lib CD4000.lib
.lib C:\Users\Parmeet Singh Ghai\Documents\GitHub\AutomatedLockSystem\LTSpice\ULN2003.lib
.lib 74hc.lib
.lib C:\Users\Parmeet Singh Ghai\Documents\GitHub\AutomatedLockSystem\LTSpice\CD4015B.sub
.backanno
.end